# EAGLE design 7333 (EAGLE 9.6.2)
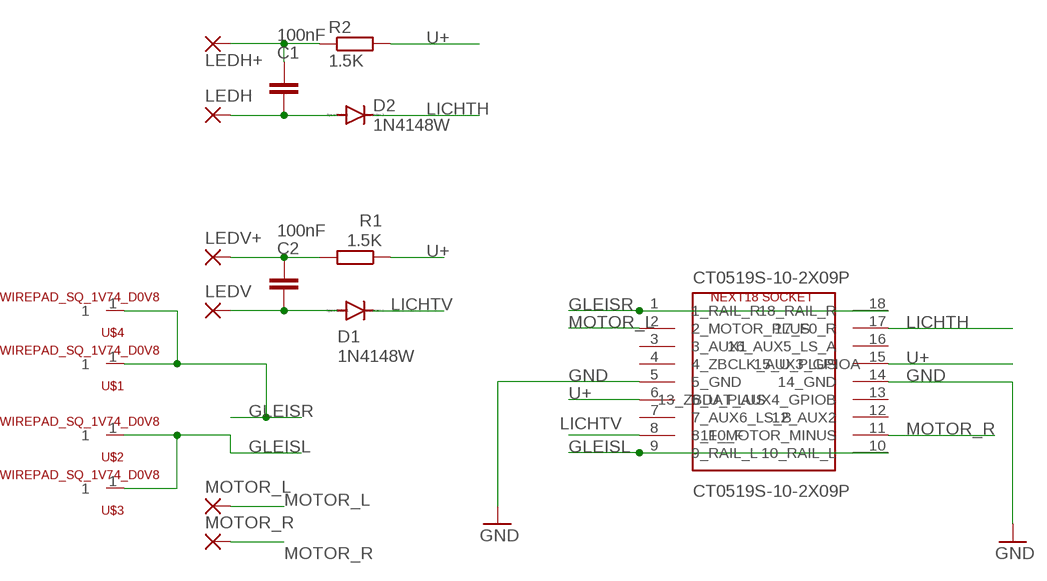
[diagram p0: schematic, sheet 1]

## Parts
C1  100nF  C-EUC0805  [C0805]
C2  100nF  C-EUC0805  [C0805]
CT0519S-10-2X09P  CT0519S-10-2X09P  NEXT18_SOCKET-GENERIC-VERIFY  [NEXT18_SOCKET_GENERIC_VERIFY]
D1  1N4148W  DIODE-SOD123  [SOD123]
D2  1N4148W  DIODE-SOD123  [SOD123]
LEDH  SMD2  [SMD1,27-2,54]
LEDH+  SMD2  [SMD1,27-2,54]
LEDV  SMD2  [SMD1,27-2,54]
LEDV+  SMD2  [SMD1,27-2,54]
MOTOR_L  SMD5  [SMD2,54-5,08]
MOTOR_R  SMD5  [SMD2,54-5,08]
R1  1.5K  R-EU_M0805  [M0805]
R2  1.5K  R-EU_M0805  [M0805]
U$1  WIREPAD_SQ_1V74_D0V8  [WIREPAD_SQ_1V74_D0V8]
U$2  WIREPAD_SQ_1V74_D0V8  [WIREPAD_SQ_1V74_D0V8]
U$3  WIREPAD_SQ_1V74_D0V8  [WIREPAD_SQ_1V74_D0V8]
U$4  WIREPAD_SQ_1V74_D0V8  [WIREPAD_SQ_1V74_D0V8]

## Nets
GLEISL: CT0519S-10-2X09P.9(9_RAIL_L) CT0519S-10-2X09P.10(10_RAIL_L) U$2.1 U$3.1
GLEISR: CT0519S-10-2X09P.1(1_RAIL_R) CT0519S-10-2X09P.18(18_RAIL_R) U$1.1 U$4.1
GND: CT0519S-10-2X09P.5(5_GND) CT0519S-10-2X09P.14(14_GND)
LICHTH: CT0519S-10-2X09P.17(17_F0_R) D2.C
LICHTV: CT0519S-10-2X09P.8(8_F0_F) D1.C
MOTOR_L: CT0519S-10-2X09P.2(2_MOTOR_PLUS) MOTOR_L.1(P)
MOTOR_R: CT0519S-10-2X09P.11(11_MOTOR_MINUS) MOTOR_R.1(P)
N$7: C1.1 LEDH+.1(P) R2.1
N$9: C2.2 D1.A LEDV.1(P)
N$10: C2.1 LEDV+.1(P) R1.2
N$11: C1.2 D2.A LEDH.1(P)
U+: CT0519S-10-2X09P.6(6_U_PLUS) CT0519S-10-2X09P.15(15_U_PLUS) R1.1 R2.2
Unconnected: CT0519S-10-2X09P.3(3_AUX1) CT0519S-10-2X09P.4(4_ZBCLK_AUX3_GPIOA) CT0519S-10-2X09P.7(7_AUX6_LS_B) CT0519S-10-2X09P.12(12_AUX2) CT0519S-10-2X09P.13(13_ZBDAT_AUX4_GPIOB) CT0519S-10-2X09P.16(16_AUX5_LS_A)

## Library data of the parts
C1 C2 = rcl:C-EU: CAPACITOR, European symbol; SPICEPREFIX: C
CT0519S-10-2X09P = next18_socket_rcn118_FIXED:NEXT18_SOCKET: Next18 / Next18-S vehicle socket Symbol follows RailCommunity RCN-118 pin names. Device contains a generic preliminary footprint.
D1 D2 = diode:DIODE-: DIODE
LEDH LEDH+ LEDV LEDV+ = wirepad:SMD2: SMD PAD
MOTOR_L MOTOR_R = wirepad:SMD5: SMD PAD
R1 R2 = rcl:R-EU_: RESISTOR, European symbol; SPICEPREFIX: R
U$1-U$4 = lokpads:WIREPAD_SQ_1V74_D0V8

## Board
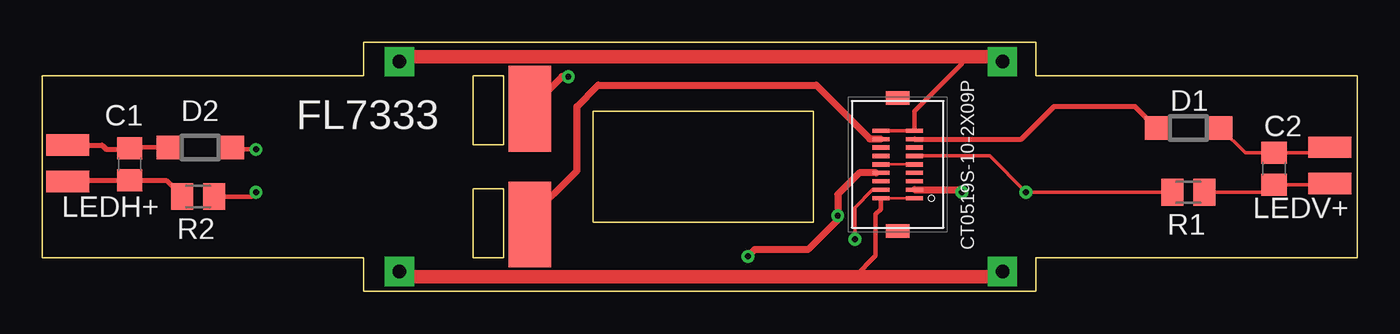
[diagram p1: board, top side]
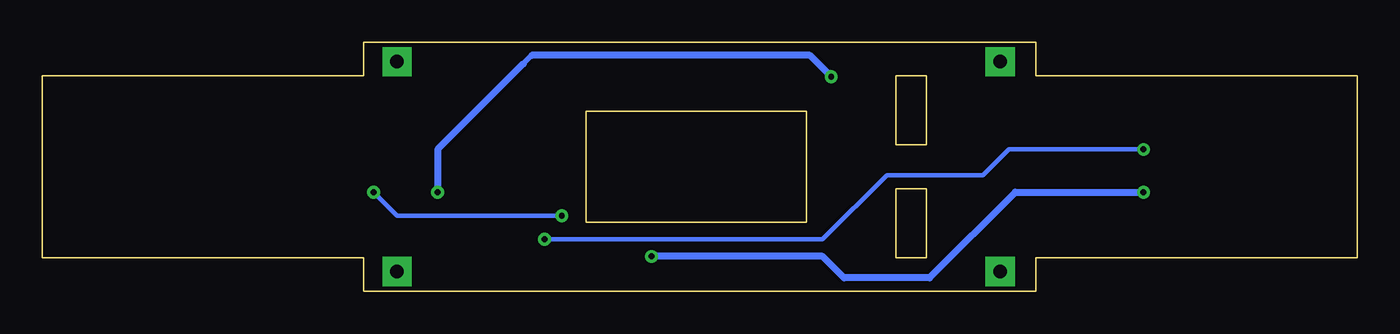
[diagram p2: board, bottom side, seen from below]

Size 78.1 x 14.8 mm. Coordinates in mm from the lower left corner, seen from the top.
Outline: 45.8,4.1 45.8,10.7 32.7,10.7 32.7,4.1 45.8,4.1
Outline: 0,2 19.1,2 19.1,0 59,0 59,2 78.1,2 78.1,12.8 59,12.8 59,14.8 19.1,14.8 19.1,12.8 0,12.8 0,2
Outline: 25.6,8.7 27.4,8.7 27.4,12.8 25.6,12.8 25.6,8.7
Outline: 25.6,2 27.4,2 27.4,6.1 25.6,6.1 25.6,2
Copper layers (1*16): Top 0.035mm / dielectric 1.5mm / Bottom 0.035mm
Design rules "default *": minimum track width 6mil, minimum drill 0.35mm, track to track 6mil, track to pad 6mil, pad to pad 6mil, via to via 6mil, smd to smd 6mil, copper to edge 6mil, drill to drill 6mil, minimum pad ring 10mil, minimum via ring 8mil, stop-mask expansion 4mil, vias tented up to drill 0mil, thermal gap 10mil

### Footprints (pad centres in the part's own frame; a part is rotated, then mirrored left to right if it is on the bottom)
C0805 = smd 1.3 x 1.5: 1 -0.95,0; 2 0.95,0
NEXT18_SOCKET_GENERIC_VERIFY = smd 0.25 x 1: 1 -2,-1; 2 -1.5,-1; 3 -1,-1; 4 -0.5,-1; 5 0,-1; 6 0.5,-1; 7 1,-1; 8 1.5,-1; 9 2,-1; 10 2,1; 11 1.5,1; 12 1,1; 13 0.5,1; 14 0,1; 15 -0.5,1; 16 -1,1; 17 -1.5,1; 18 -2,1 | smd 0.8 x 1.4: MP1 -3.95,0; MP2 3.95,0
SOD123 = smd 1.4 x 1.4: A 1.9,0; C -1.9,0
SMD1,27-2,54 = smd 1.27 x 2.54: 1 0,0
SMD2,54-5,08 = smd 2.54 x 5.08: 1 0,0
M0805 = smd 1.3 x 1.6: 1 -0.95,0; 2 0.95,0
WIREPAD_SQ_1V74_D0V8 = drill 0.8 pad 1.74 square: 1 0,0

### Placement (x,y rotation side)
C1  5.21,7.54 90 top
C2  73.15,7.29 90 top
CT0519S-10-2X09P  50.8,7.54 90 top
D1  68.07,9.7 0 top
D2  9.4,8.56 180 top
LEDH  1.52,8.68 90 top
LEDH+  1.52,6.53 270 top
LEDV  76.45,8.56 90 top
LEDV+  76.45,6.4 90 top
MOTOR_L  28.96,10.84 180 top
MOTOR_R  28.96,3.99 180 top
R1  68.07,5.89 0 top
R2  9.27,5.64 0 top
U$1  21.21,1.19 0 top
U$2  21.21,13.64 0 top
U$3  57.02,13.64 0 top
U$4  57.02,1.19 0 top

### Tracks (layer width: path | path; a pad name or v marks a point on that pad's centre or on a via)
GLEISL
  Top 0.2: CT0519S-10-2X09P.10 CT0519S-10-2X09P.9 | 54.61,13.51 54.61,13.94
  Top 0.254: CT0519S-10-2X09P.9 51.8,10.7 54.61,13.51
  Top 0.813: U$2.1 21.51,13.94 54.61,13.94 56.72,13.94 U$3.1
GLEISR
  Top 0.152: CT0519S-10-2X09P.1 CT0519S-10-2X09P.18
  Top 0.254: CT0519S-10-2X09P.18 49.8,4.89 49.49,4.58 49.49,2.12 48.26,0.89
  Top 0.813: U$1.1 21.51,0.89 48.26,0.89 56.72,0.89 U$4.1
GND
  Top 0.152: CT0519S-10-2X09P.14 CT0519S-10-2X09P.5
LICHTH  (via drill 0.35)
  Top 0.2: v48.26,3.1 48.26,4.98 49.32,6.04 CT0519S-10-2X09P.17
  Top 0.254: v12.7,8.43 11.43,8.43 D2.C
  Bottom 0.254: v48.26,3.1 31.75,3.1 27.95,6.9 22.23,6.9 20.7,8.43 v12.7,8.43
LICHTV
  Top 0.305: CT0519S-10-2X09P.8 58.15,9.04 60.08,10.97 64.9,10.97 D1.C
MOTOR_L  (via drill 0.35)
  Top 0.406: MOTOR_L.1 30.86,12.75 v31.24,12.75 | CT0519S-10-2X09P.2 54.46,6.04 v54.61,5.89
  Bottom 0.305: 49.02,14.02 49.53,13.51
  Bottom 0.406: v31.24,12.75 32.51,14.02 49.02,14.02 | 49.53,13.51 54.61,8.43 v54.61,5.89
MOTOR_R
  Top 0.406: MOTOR_R.1 28.96,4.37 31.75,7.16 31.75,10.95 31.75,10.97 33.02,12.24 45.97,12.24 49.15,9.06 49.78,9.06 CT0519S-10-2X09P.11
N$7
  Top 0.305: LEDH+.1 1.59,6.59 C1.1 7.37,6.59 R2.1
N$9
  Top 0.2: LEDV.1 76.13,8.24 73.66,8.24 C2.2 71.44,8.24 D1.A
N$10
  Top 0.2: R1.2 72.7,5.89 C2.1 76.39,6.34 LEDV+.1
N$11
  Top 0.254: 5.27,8.56 D2.A
  Top 0.305: 5.27,8.56 C1.2 5.15,8.43 3.81,8.43 3.56,8.68 LEDH.1
U+  (via drill 0.35)
  Top 0.2: R1.1 v58.42,5.89 56.27,8.04 CT0519S-10-2X09P.6
  Top 0.254: CT0519S-10-2X09P.15 49.53,7.04 | v12.7,5.89 12.45,5.64 11.43,5.64 R2.2 | v47.24,4.49
  Top 0.406: v41.91,2.08 42.31,2.48 45.46,2.48 47.24,4.26 v47.24,4.49 47.24,5.76 48.53,7.04 49.53,7.04
  Bottom 0.254: v58.42,5.89 57.02,4.49 v47.24,4.49
  Bottom 0.406: v12.7,5.89 20.32,5.89 25.4,0.81 30.48,0.81 31.75,2.08 v41.91,2.08

### Text on the board
tPlace: FL7333